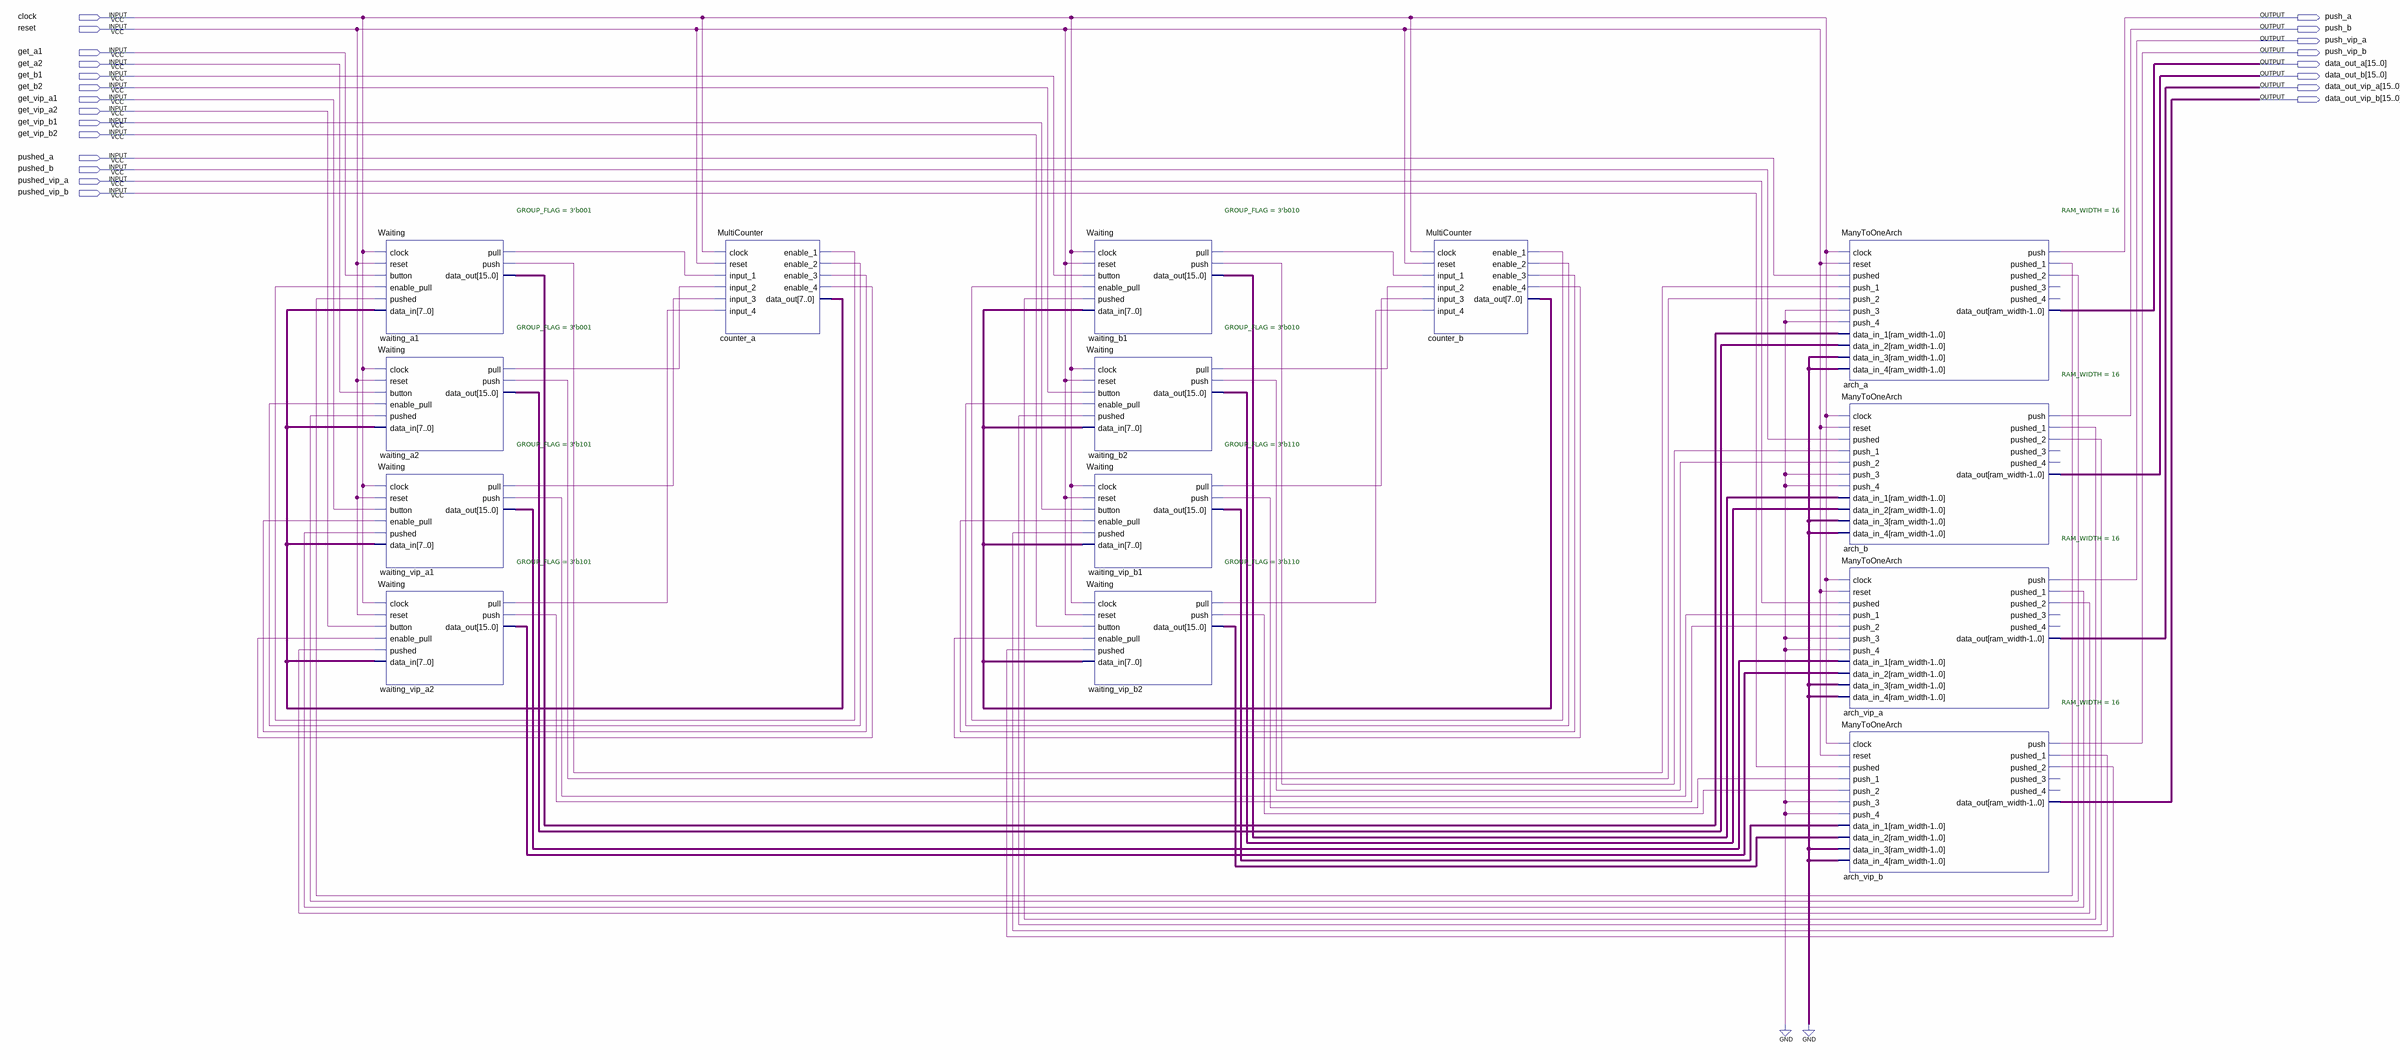
[diagram p0: schematic sheet]
// Quartus schematic MultiWaitings.bdf as structural Verilog: 14 symbols, 22 pins
module MultiWaitings (
  input  clock,
  input  reset,
  input  get_a1,
  input  get_a2,
  input  get_b1,
  input  get_b2,
  input  get_vip_a1,
  input  get_vip_a2,
  input  get_vip_b1,
  input  get_vip_b2,
  input  pushed_a,
  input  pushed_b,
  input  pushed_vip_a,
  input  pushed_vip_b,
  output push_a,
  output push_b,
  output push_vip_a,
  output push_vip_b,
  output [15:0] data_out_a,
  output [15:0] data_out_b,
  output [15:0] data_out_vip_a,
  output [15:0] data_out_vip_b
);

  wire arch_a_pushed_1, arch_a_pushed_2, arch_b_pushed_1, arch_b_pushed_2, arch_vip_a_pushed_1,
       arch_vip_a_pushed_2, arch_vip_b_pushed_1, arch_vip_b_pushed_2, counter_a_enable_1, counter_a_enable_2,
       counter_a_enable_3, counter_a_enable_4, counter_b_enable_1, counter_b_enable_2, counter_b_enable_3,
       counter_b_enable_4, waiting_a1_pull, waiting_a1_push, waiting_a2_pull, waiting_a2_push,
       waiting_b1_pull, waiting_b1_push, waiting_b2_pull, waiting_b2_push, waiting_vip_a1_pull,
       waiting_vip_a1_push, waiting_vip_a2_pull, waiting_vip_a2_push, waiting_vip_b1_pull,
       waiting_vip_b1_push, waiting_vip_b2_pull, waiting_vip_b2_push;
  wire [7:0] counter_a_data_out, counter_b_data_out;
  wire [15:0] waiting_a1_data_out, waiting_a2_data_out, waiting_b1_data_out, waiting_b2_data_out,
       waiting_vip_a1_data_out, waiting_vip_a2_data_out, waiting_vip_b1_data_out, waiting_vip_b2_data_out;

  Waiting #(.GROUP_FLAG(3'b001)) waiting_a1 (
    .clock(clock), .reset(reset), .button(get_a1), .enable_pull(counter_a_enable_1),
    .pushed(arch_a_pushed_1), .data_in(counter_a_data_out), .pull(waiting_a1_pull), .push(waiting_a1_push),
    .data_out(waiting_a1_data_out));
  Waiting #(.GROUP_FLAG(3'b001)) waiting_a2 (
    .clock(clock), .reset(reset), .button(get_a2), .enable_pull(counter_a_enable_2),
    .pushed(arch_a_pushed_2), .data_in(counter_a_data_out), .pull(waiting_a2_pull), .push(waiting_a2_push),
    .data_out(waiting_a2_data_out));
  Waiting #(.GROUP_FLAG(3'b101)) waiting_vip_a1 (
    .clock(clock), .reset(reset), .button(get_vip_a1), .enable_pull(counter_a_enable_3),
    .pushed(arch_vip_a_pushed_1), .data_in(counter_a_data_out), .pull(waiting_vip_a1_pull),
    .push(waiting_vip_a1_push), .data_out(waiting_vip_a1_data_out));
  Waiting #(.GROUP_FLAG(3'b101)) waiting_vip_a2 (
    .clock(clock), .reset(reset), .button(get_vip_a2), .enable_pull(counter_a_enable_4),
    .pushed(arch_vip_a_pushed_2), .data_in(counter_a_data_out), .pull(waiting_vip_a2_pull),
    .push(waiting_vip_a2_push), .data_out(waiting_vip_a2_data_out));
  MultiCounter counter_a (
    .clock(clock), .reset(reset), .input_1(waiting_a1_pull), .input_2(waiting_a2_pull),
    .input_3(waiting_vip_a1_pull), .input_4(waiting_vip_a2_pull), .enable_1(counter_a_enable_1),
    .enable_2(counter_a_enable_2), .enable_3(counter_a_enable_3), .enable_4(counter_a_enable_4),
    .data_out(counter_a_data_out));
  Waiting #(.GROUP_FLAG(3'b010)) waiting_b1 (
    .clock(clock), .reset(reset), .button(get_b1), .enable_pull(counter_b_enable_1),
    .pushed(arch_b_pushed_1), .data_in(counter_b_data_out), .pull(waiting_b1_pull), .push(waiting_b1_push),
    .data_out(waiting_b1_data_out));
  Waiting #(.GROUP_FLAG(3'b010)) waiting_b2 (
    .clock(clock), .reset(reset), .button(get_b2), .enable_pull(counter_b_enable_2),
    .pushed(arch_b_pushed_2), .data_in(counter_b_data_out), .pull(waiting_b2_pull), .push(waiting_b2_push),
    .data_out(waiting_b2_data_out));
  Waiting #(.GROUP_FLAG(3'b110)) waiting_vip_b1 (
    .clock(clock), .reset(reset), .button(get_vip_b1), .enable_pull(counter_b_enable_3),
    .pushed(arch_vip_b_pushed_1), .data_in(counter_b_data_out), .pull(waiting_vip_b1_pull),
    .push(waiting_vip_b1_push), .data_out(waiting_vip_b1_data_out));
  Waiting #(.GROUP_FLAG(3'b110)) waiting_vip_b2 (
    .clock(clock), .reset(reset), .button(get_vip_b2), .enable_pull(counter_b_enable_4),
    .pushed(arch_vip_b_pushed_2), .data_in(counter_b_data_out), .pull(waiting_vip_b2_pull),
    .push(waiting_vip_b2_push), .data_out(waiting_vip_b2_data_out));
  MultiCounter counter_b (
    .clock(clock), .reset(reset), .input_1(waiting_b1_pull), .input_2(waiting_b2_pull),
    .input_3(waiting_vip_b1_pull), .input_4(waiting_vip_b2_pull), .enable_1(counter_b_enable_1),
    .enable_2(counter_b_enable_2), .enable_3(counter_b_enable_3), .enable_4(counter_b_enable_4),
    .data_out(counter_b_data_out));
  ManyToOneArch #(.RAM_WIDTH(16)) arch_a (
    .clock(clock), .reset(reset), .pushed(pushed_a), .push_1(waiting_a1_push), .push_2(waiting_a2_push),
    .push_3(1'b0), .push_4(1'b0), .data_in_1(waiting_a1_data_out), .data_in_2(waiting_a2_data_out),
    .data_in_3({16{1'b0}}), .data_in_4({16{1'b0}}), .push(push_a), .pushed_1(arch_a_pushed_1),
    .pushed_2(arch_a_pushed_2), .data_out(data_out_a));  // open: pushed_3, pushed_4
  ManyToOneArch #(.RAM_WIDTH(16)) arch_b (
    .clock(clock), .reset(reset), .pushed(pushed_b), .push_1(waiting_b1_push), .push_2(waiting_b2_push),
    .push_3(1'b0), .push_4(1'b0), .data_in_1(waiting_b1_data_out), .data_in_2(waiting_b2_data_out),
    .data_in_3({16{1'b0}}), .data_in_4({16{1'b0}}), .push(push_b), .pushed_1(arch_b_pushed_1),
    .pushed_2(arch_b_pushed_2), .data_out(data_out_b));  // open: pushed_3, pushed_4
  ManyToOneArch #(.RAM_WIDTH(16)) arch_vip_a (
    .clock(clock), .reset(reset), .pushed(pushed_vip_a), .push_1(waiting_vip_a1_push),
    .push_2(waiting_vip_a2_push), .push_3(1'b0), .push_4(1'b0), .data_in_1(waiting_vip_a1_data_out),
    .data_in_2(waiting_vip_a2_data_out), .data_in_3({16{1'b0}}), .data_in_4({16{1'b0}}), .push(push_vip_a),
    .pushed_1(arch_vip_a_pushed_1), .pushed_2(arch_vip_a_pushed_2), .data_out(data_out_vip_a));  // open: pushed_3, pushed_4
  ManyToOneArch #(.RAM_WIDTH(16)) arch_vip_b (
    .clock(clock), .reset(reset), .pushed(pushed_vip_b), .push_1(waiting_vip_b1_push),
    .push_2(waiting_vip_b2_push), .push_3(1'b0), .push_4(1'b0), .data_in_1(waiting_vip_b1_data_out),
    .data_in_2(waiting_vip_b2_data_out), .data_in_3({16{1'b0}}), .data_in_4({16{1'b0}}), .push(push_vip_b),
    .pushed_1(arch_vip_b_pushed_1), .pushed_2(arch_vip_b_pushed_2), .data_out(data_out_vip_b));  // open: pushed_3, pushed_4
endmodule
